# Altium schematic sheet LEDArray.SchDoc
size A2; SheetNumber: 3
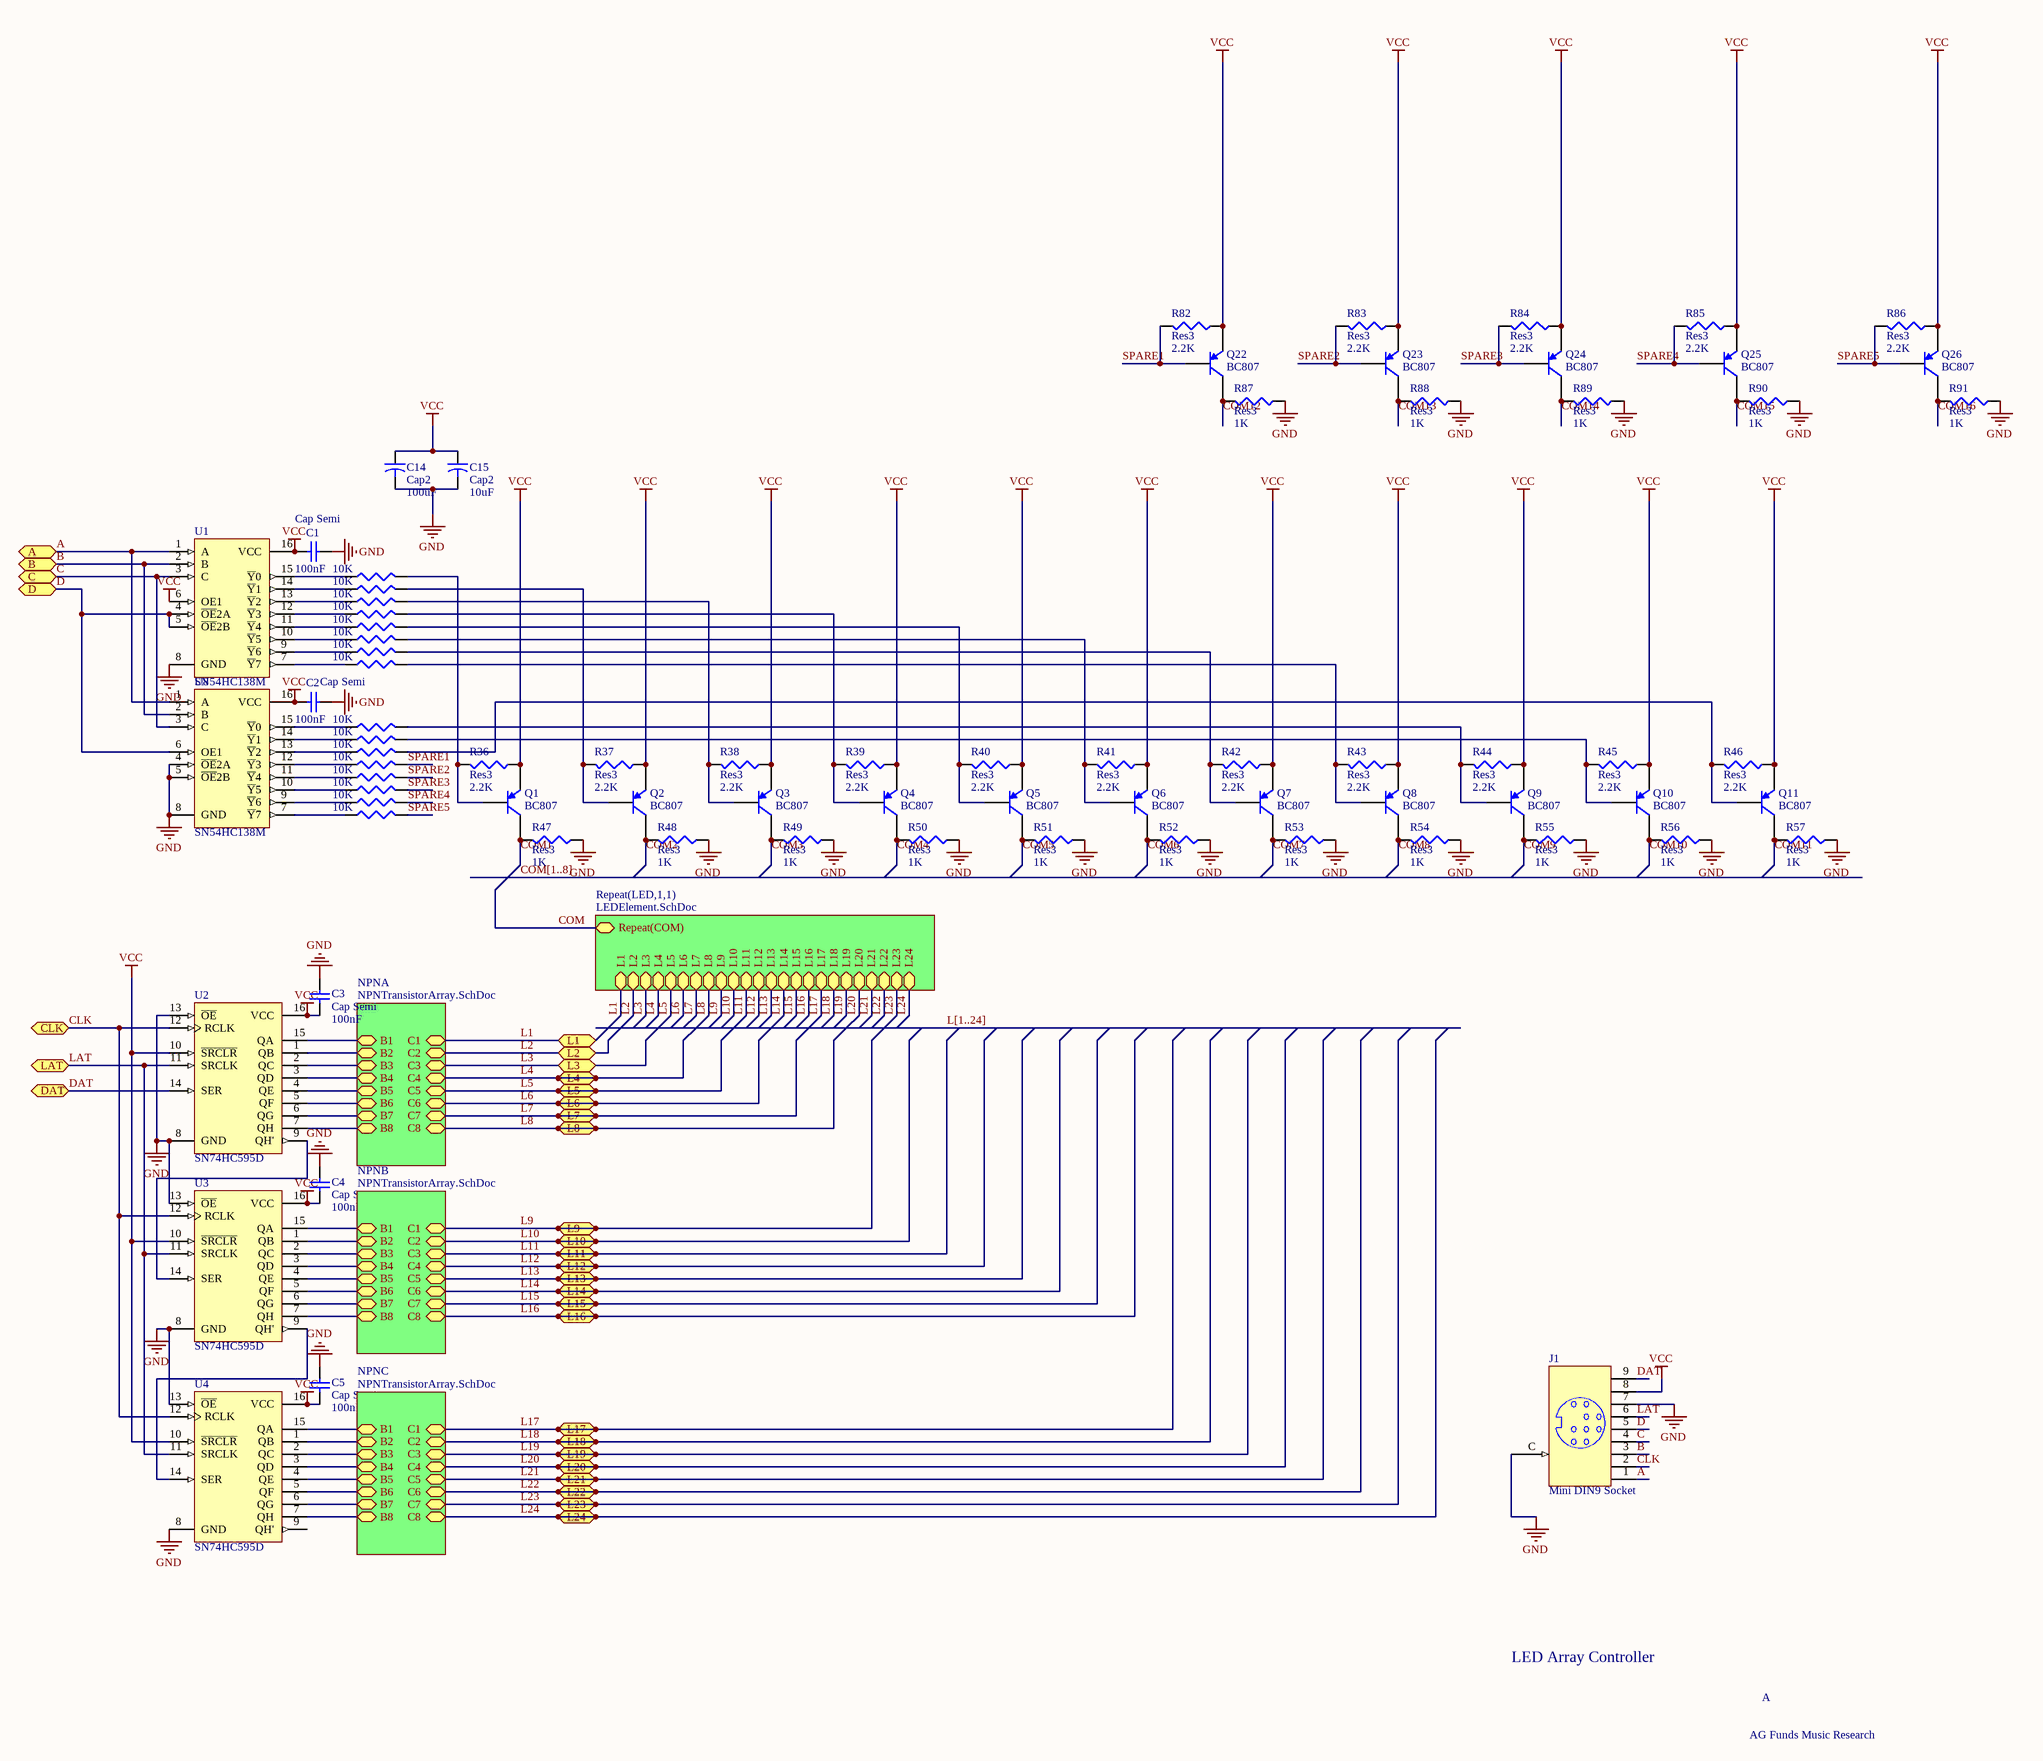
[diagram p0: LEDArray.SchDoc]

## Parts
C1  Cap Semi  value 100nF  [1608[0603]]
C2  Cap Semi  value 100nF  [1608[0603]]
C3  Cap Semi  value 100nF  [1608[0603]]
C4  Cap Semi  value 100nF  [1608[0603]]
C5  Cap Semi  value 100nF  [1608[0603]]
C14  Cap2  value 100uF  [CAPR5-4X5]
C15  Cap2  value 10uF  [CAPR5-4X5]
J1  Mini DIN9 Socket  [9miniDIN]
Q1  BC807  [SOT23-3M]
Q2  BC807  [SOT23-3M]
Q3  BC807  [SOT23-3M]
Q4  BC807  [SOT23-3M]
Q5  BC807  [SOT23-3M]
Q6  BC807  [SOT23-3M]
Q7  BC807  [SOT23-3M]
Q8  BC807  [SOT23-3M]
Q9  BC807  [SOT23-3M]
Q10  BC807  [SOT23-3M]
Q11  BC807  [SOT23-3M]
Q22  BC807  [SOT23-3M]
Q23  BC807  [SOT23-3M]
Q24  BC807  [SOT23-3M]
Q25  BC807  [SOT23-3M]
Q26  BC807  [SOT23-3M]
R25  value 10K  [J1-0603]  (hidden comment: Res3)
R26  value 10K  [J1-0603]  (hidden comment: Res3)
R27  value 10K  [J1-0603]  (hidden comment: Res3)
R28  value 10K  [J1-0603]  (hidden comment: Res3)
R29  value 10K  [J1-0603]  (hidden comment: Res3)
R30  value 10K  [J1-0603]  (hidden comment: Res3)
R31  value 10K  [J1-0603]  (hidden comment: Res3)
R32  value 10K  [J1-0603]  (hidden comment: Res3)
R33  value 10K  [J1-0603]  (hidden comment: Res3)
R34  value 10K  [J1-0603]  (hidden comment: Res3)
R35  value 10K  [J1-0603]  (hidden comment: Res3)
R36  Res3  value 2.2K  [J1-0603]
R37  Res3  value 2.2K  [J1-0603]
R38  Res3  value 2.2K  [J1-0603]
R39  Res3  value 2.2K  [J1-0603]
R40  Res3  value 2.2K  [J1-0603]
R41  Res3  value 2.2K  [J1-0603]
R42  Res3  value 2.2K  [J1-0603]
R43  Res3  value 2.2K  [J1-0603]
R44  Res3  value 2.2K  [J1-0603]
R45  Res3  value 2.2K  [J1-0603]
R46  Res3  value 2.2K  [J1-0603]
R47  Res3  value 1K  [J1-0603]
R48  Res3  value 1K  [J1-0603]
R49  Res3  value 1K  [J1-0603]
R50  Res3  value 1K  [J1-0603]
R51  Res3  value 1K  [J1-0603]
R52  Res3  value 1K  [J1-0603]
R53  Res3  value 1K  [J1-0603]
R54  Res3  value 1K  [J1-0603]
R55  Res3  value 1K  [J1-0603]
R56  Res3  value 1K  [J1-0603]
R57  Res3  value 1K  [J1-0603]
R82  Res3  value 2.2K  [J1-0603]
R83  Res3  value 2.2K  [J1-0603]
R84  Res3  value 2.2K  [J1-0603]
R85  Res3  value 2.2K  [J1-0603]
R86  Res3  value 2.2K  [J1-0603]
R87  Res3  value 1K  [J1-0603]
R88  Res3  value 1K  [J1-0603]
R89  Res3  value 1K  [J1-0603]
R90  Res3  value 1K  [J1-0603]
R91  Res3  value 1K  [J1-0603]
R92  value 10K  [J1-0603]  (hidden comment: Res3)
R93  value 10K  [J1-0603]  (hidden comment: Res3)
R94  value 10K  [J1-0603]  (hidden comment: Res3)
R95  value 10K  [J1-0603]  (hidden comment: Res3)
R96  value 10K  [J1-0603]  (hidden comment: Res3)
U1  SN54HC138M  [SOIC127P602-16BM]
U2  SN74HC595D  [D016_N]
U3  SN74HC595D  [D016_N]
U4  SN74HC595D  [D016_N]
U8  SN54HC138M  [SOIC127P602-16BM]

## Sub-sheets
NPNA = NPNTransistorArray.SchDoc: B1, B2, B3, B4, B5, B6, B7, B8, C1, C2, C3, C4, C5, C6, C7, C8
NPNB = NPNTransistorArray.SchDoc: B1, B2, B3, B4, B5, B6, B7, B8, C1, C2, C3, C4, C5, C6, C7, C8
NPNC = NPNTransistorArray.SchDoc: B1, B2, B3, B4, B5, B6, B7, B8, C1, C2, C3, C4, C5, C6, C7, C8
Repeat(LED,1,1) = LEDElement.SchDoc: L1, L2, L3, L4, L5, L6, L7, L8, L9, L10, L11, L12, L13, L14, L15, L16, L18, L17, L19, L20, L22, L21, L23, L24, Repeat(COM)

## Ports
A, B, C, CLK, D, DAT, L1, L2, L3, L4, L5, L6, L7, L8, L9, L10, L11, L12, L13, L14, L15, L16, L17, L18, L19, L20, L21, L22, L23, L24, LAT

## Nets
GND: C1.2 C2.2 C3.1 C4.1 C5.1 C14.2 C15.2 J1.7 J1.C R47.1 R48.1 R49.1 R50.1 R51.1 R52.1 R53.1 R54.1 R55.1 R56.1 R57.1 R87.1 R88.1 R89.1 R90.1 R91.1 U1.8(GND) U2.8(GND) U2.13(~{OE}) U3.8(GND) U3.13(~{OE}) U4.8(GND) U4.13(~{OE}) U8.4(~{OE}2A) U8.5(~{OE}2B) U8.8(GND)
VCC: C1.1 C2.1 C3.2 C4.2 C5.2 C14.1 C15.1 J1.8 Q1.2(E) Q2.2(E) Q3.2(E) Q4.2(E) Q5.2(E) Q6.2(E) Q7.2(E) Q8.2(E) Q9.2(E) Q10.2(E) Q11.2(E) Q22.2(E) Q23.2(E) Q24.2(E) Q25.2(E) Q26.2(E) R36.1 R37.1 R38.1 R39.1 R40.1 R41.1 R42.1 R43.1 R44.1 R45.1 R46.1 R82.1 R83.1 R84.1 R85.1 R86.1 U1.6(OE1) U1.16(VCC) U2.10(~{SRCLR}) U2.16(VCC) U3.10(~{SRCLR}) U3.16(VCC) U4.10(~{SRCLR}) U4.16(VCC) U8.16(VCC)
A: J1.1 U1.1(A) U8.1(A) ; port A
B: J1.3 U1.2(B) U8.2(B) ; port B
C: J1.4 U1.3(C) U8.3(C) ; port C
CLK: J1.2 U2.12(RCLK) U3.12(RCLK) U4.12(RCLK) ; port CLK
COM: sheet Repeat(LED,1,1)/Repeat(COM)
COM1: Q1.3(C) R47.2
COM2: Q2.3(C) R48.2
COM3: Q3.3(C) R49.2
COM4: Q4.3(C) R50.2
COM5: Q5.3(C) R51.2
COM6: Q6.3(C) R52.2
COM7: Q7.3(C) R53.2
COM8: Q8.3(C) R54.2
COM9: Q9.3(C) R55.2
COM10: Q10.3(C) R56.2
COM11: Q11.3(C) R57.2
COM12: Q22.3(C) R87.2
COM13: Q23.3(C) R88.2
COM14: Q24.3(C) R89.2
COM15: Q25.3(C) R90.2
COM16: Q26.3(C) R91.2
D: J1.5 U1.4(~{OE}2A) U1.5(~{OE}2B) U8.6(OE1) ; port D
DAT: J1.9 U2.14(SER) ; port DAT
L1: port L1, sheet Repeat(LED,1,1)/L1, sheet NPNA/C1
L2: port L2, sheet Repeat(LED,1,1)/L2, sheet NPNA/C2
L3: port L3, sheet Repeat(LED,1,1)/L3, sheet NPNA/C3
L4: port L4, sheet Repeat(LED,1,1)/L4, sheet NPNA/C4
L5: port L5, sheet Repeat(LED,1,1)/L5, sheet NPNA/C5
L6: port L6, sheet Repeat(LED,1,1)/L6, sheet NPNA/C6
L7: port L7, sheet Repeat(LED,1,1)/L7, sheet NPNA/C7
L8: port L8, sheet Repeat(LED,1,1)/L8, sheet NPNA/C8
L9: port L9, sheet Repeat(LED,1,1)/L9, sheet NPNB/C1
L10: port L10, sheet Repeat(LED,1,1)/L10, sheet NPNB/C2
L11: port L11, sheet Repeat(LED,1,1)/L11, sheet NPNB/C3
L12: port L12, sheet Repeat(LED,1,1)/L12, sheet NPNB/C4
L13: port L13, sheet Repeat(LED,1,1)/L13, sheet NPNB/C5
L14: port L14, sheet Repeat(LED,1,1)/L14, sheet NPNB/C6
L15: port L15, sheet Repeat(LED,1,1)/L15, sheet NPNB/C7
L16: port L16, sheet Repeat(LED,1,1)/L16, sheet NPNB/C8
L17: port L17, sheet Repeat(LED,1,1)/L17, sheet NPNC/C1
L18: port L18, sheet Repeat(LED,1,1)/L18, sheet NPNC/C2
L19: port L19, sheet Repeat(LED,1,1)/L19, sheet NPNC/C3
L20: port L20, sheet Repeat(LED,1,1)/L20, sheet NPNC/C4
L21: port L21, sheet Repeat(LED,1,1)/L21, sheet NPNC/C5
L22: port L22, sheet Repeat(LED,1,1)/L22, sheet NPNC/C6
L23: port L23, sheet Repeat(LED,1,1)/L23, sheet NPNC/C7
L24: port L24, sheet Repeat(LED,1,1)/L24, sheet NPNC/C8
LAT: J1.6 U2.11(SRCLK) U3.11(SRCLK) U4.11(SRCLK) ; port LAT
SPARE1: Q22.1(B) R82.2 R92.2
SPARE2: Q23.1(B) R83.2 R93.2
SPARE3: Q24.1(B) R84.2 R94.2
SPARE4: Q25.1(B) R85.2 R95.2
SPARE5: Q26.1(B) R86.2 R96.2
NetQ1_1: Q1.1(B) R25.2 R36.2
NetQ2_1: Q2.1(B) R26.2 R37.2
NetQ3_1: Q3.1(B) R27.2 R38.2
NetQ4_1: Q4.1(B) R28.2 R39.2
NetQ5_1: Q5.1(B) R29.2 R40.2
NetQ6_1: Q6.1(B) R30.2 R41.2
NetQ7_1: Q7.1(B) R31.2 R42.2
NetQ8_1: Q8.1(B) R32.2 R43.2
NetQ9_1: Q9.1(B) R33.2 R44.2
NetQ10_1: Q10.1(B) R34.2 R45.2
NetQ11_1: Q11.1(B) R35.2 R46.2
NetR25_1: R25.1 U1.15(~{Y}0)
NetR26_1: R26.1 U1.14(~{Y}1)
NetR27_1: R27.1 U1.13(~{Y}2)
NetR28_1: R28.1 U1.12(~{Y}3)
NetR29_1: R29.1 U1.11(~{Y}4)
NetR30_1: R30.1 U1.10(~{Y}5)
NetR31_1: R31.1 U1.9(~{Y}6)
NetR32_1: R32.1 U1.7(~{Y}7)
NetR33_1: R33.1 U8.15(~{Y}0)
NetR34_1: R34.1 U8.14(~{Y}1)
NetR35_1: R35.1 U8.13(~{Y}2)
NetR92_1: R92.1 U8.12(~{Y}3)
NetR93_1: R93.1 U8.11(~{Y}4)
NetR94_1: R94.1 U8.10(~{Y}5)
NetR95_1: R95.1 U8.9(~{Y}6)
NetR96_1: R96.1 U8.7(~{Y}7)
NetU2_1: U2.1(QB) ; sheet NPNA/B2
NetU2_2: U2.2(QC) ; sheet NPNA/B3
NetU2_3: U2.3(QD) ; sheet NPNA/B4
NetU2_4: U2.4(QE) ; sheet NPNA/B5
NetU2_5: U2.5(QF) ; sheet NPNA/B6
NetU2_6: U2.6(QG) ; sheet NPNA/B7
NetU2_7: U2.7(QH) ; sheet NPNA/B8
NetU2_9: U2.9(QH') U3.14(SER)
NetU2_15: U2.15(QA) ; sheet NPNA/B1
NetU3_1: U3.1(QB) ; sheet NPNB/B2
NetU3_2: U3.2(QC) ; sheet NPNB/B3
NetU3_3: U3.3(QD) ; sheet NPNB/B4
NetU3_4: U3.4(QE) ; sheet NPNB/B5
NetU3_5: U3.5(QF) ; sheet NPNB/B6
NetU3_6: U3.6(QG) ; sheet NPNB/B7
NetU3_7: U3.7(QH) ; sheet NPNB/B8
NetU3_9: U3.9(QH') U4.14(SER)
NetU3_15: U3.15(QA) ; sheet NPNB/B1
NetU4_1: U4.1(QB) ; sheet NPNC/B2
NetU4_2: U4.2(QC) ; sheet NPNC/B3
NetU4_3: U4.3(QD) ; sheet NPNC/B4
NetU4_4: U4.4(QE) ; sheet NPNC/B5
NetU4_5: U4.5(QF) ; sheet NPNC/B6
NetU4_6: U4.6(QG) ; sheet NPNC/B7
NetU4_7: U4.7(QH) ; sheet NPNC/B8
NetU4_15: U4.15(QA) ; sheet NPNC/B1

Not connected (* = marked no-connect by the designer): U4 9(QH')

## Buses and harness runs
bus COM[1..8]
bus L[1..24]

## Notes on the sheet
- LED Array Controller
- A
- AG Funds Music Research

## Library data of the parts
C1-C5 = Cap Semi: Capacitor (Semiconductor SIM Model); Published: 8-Jun-2000; LatestRevisionDate: 29-May-2009; LatestRevisionNote: IPC-7351 Footprint Added.; PackageReference: C1206; Publisher: Altium Limited; PackageDescription: Chip Capacitor
C14 C15 = Cap2: Capacitor; Published: 23-Sep-2002; PackageReference: CAPR5-4X5; Publisher: Altium Limited; PackageDescription: Capacitor; 2 Leads
J1 = mDIN9: CUI Inc. MD-90S MINIDIN9 PCB Mount Socket; Published: 17-Dec-2003; Publisher: Altium Limited; ComponentLink1Description: Manufacturer Link; ComponentLink1URL: http://www.oupiin.com/prodindx.html#Headers
Q1-Q11 Q22-Q26 = BC807: BC807 PNP General Purpose Amplifier
R25-R57 R82-R96 = Res3: Resistor; Published: 8-Jun-2000; LatestRevisionDate: 29-May-2009; LatestRevisionNote: IPC-7351 Footprint Added.; PackageReference: J1-0603; Publisher: Altium Limited; PackageDescription: Chip Resistor
U1 U8 = SN54HC138J: 3-Line to 8-Line Decoder / Demultiplexer; Published: 8-Jun-2000; LatestRevisionDate: 04-Mar-2005; LatestRevisionNote: Stylized 3D Model Added.; DatasheetVersion: May-1997; PackageVersion: Jun-1999; PackageReference: J016; Publisher: Altium Limited; PackageDescription: DIP; 16 Leads; Row Spacing 7.62 mm; Pitch 2.54 mm; ComponentLink1Description: Manufacturer Link; ComponentLink1URL: http://www.ti.com/; ComponentLink2Description: Datasheet; ComponentLink2URL: http://www-s.ti.com/sc/ds/sn74hc138.pdf
U2-U4 = SN74HC595D: 8-Bit Shift Register with 3-State Output Registers; Published: 8-Jun-2000; LatestRevisionDate: 13-Apr-2006; LatestRevisionNote: IPC-7351 Footprint Added.; DatasheetVersion: May-1997; PackageVersion: Jan-1998; PackageReference: D016; Publisher: Altium Limited; PackageDescription: 16-Pin Small Outline Integrated Circuit 1.27 mm Pitch; Code_IPC: SOIC127P600-16; ComponentLink1Description: Manufacturer Link; ComponentLink1URL: http://www.ti.com/; ComponentLink2Description: Datasheet; ComponentLink2URL: http://www-s.ti.com/sc/ds/sn74hc595.pdf